# EAGLE design MultiSensor_MPL_PCA_0805 (EAGLE 9.5.2)
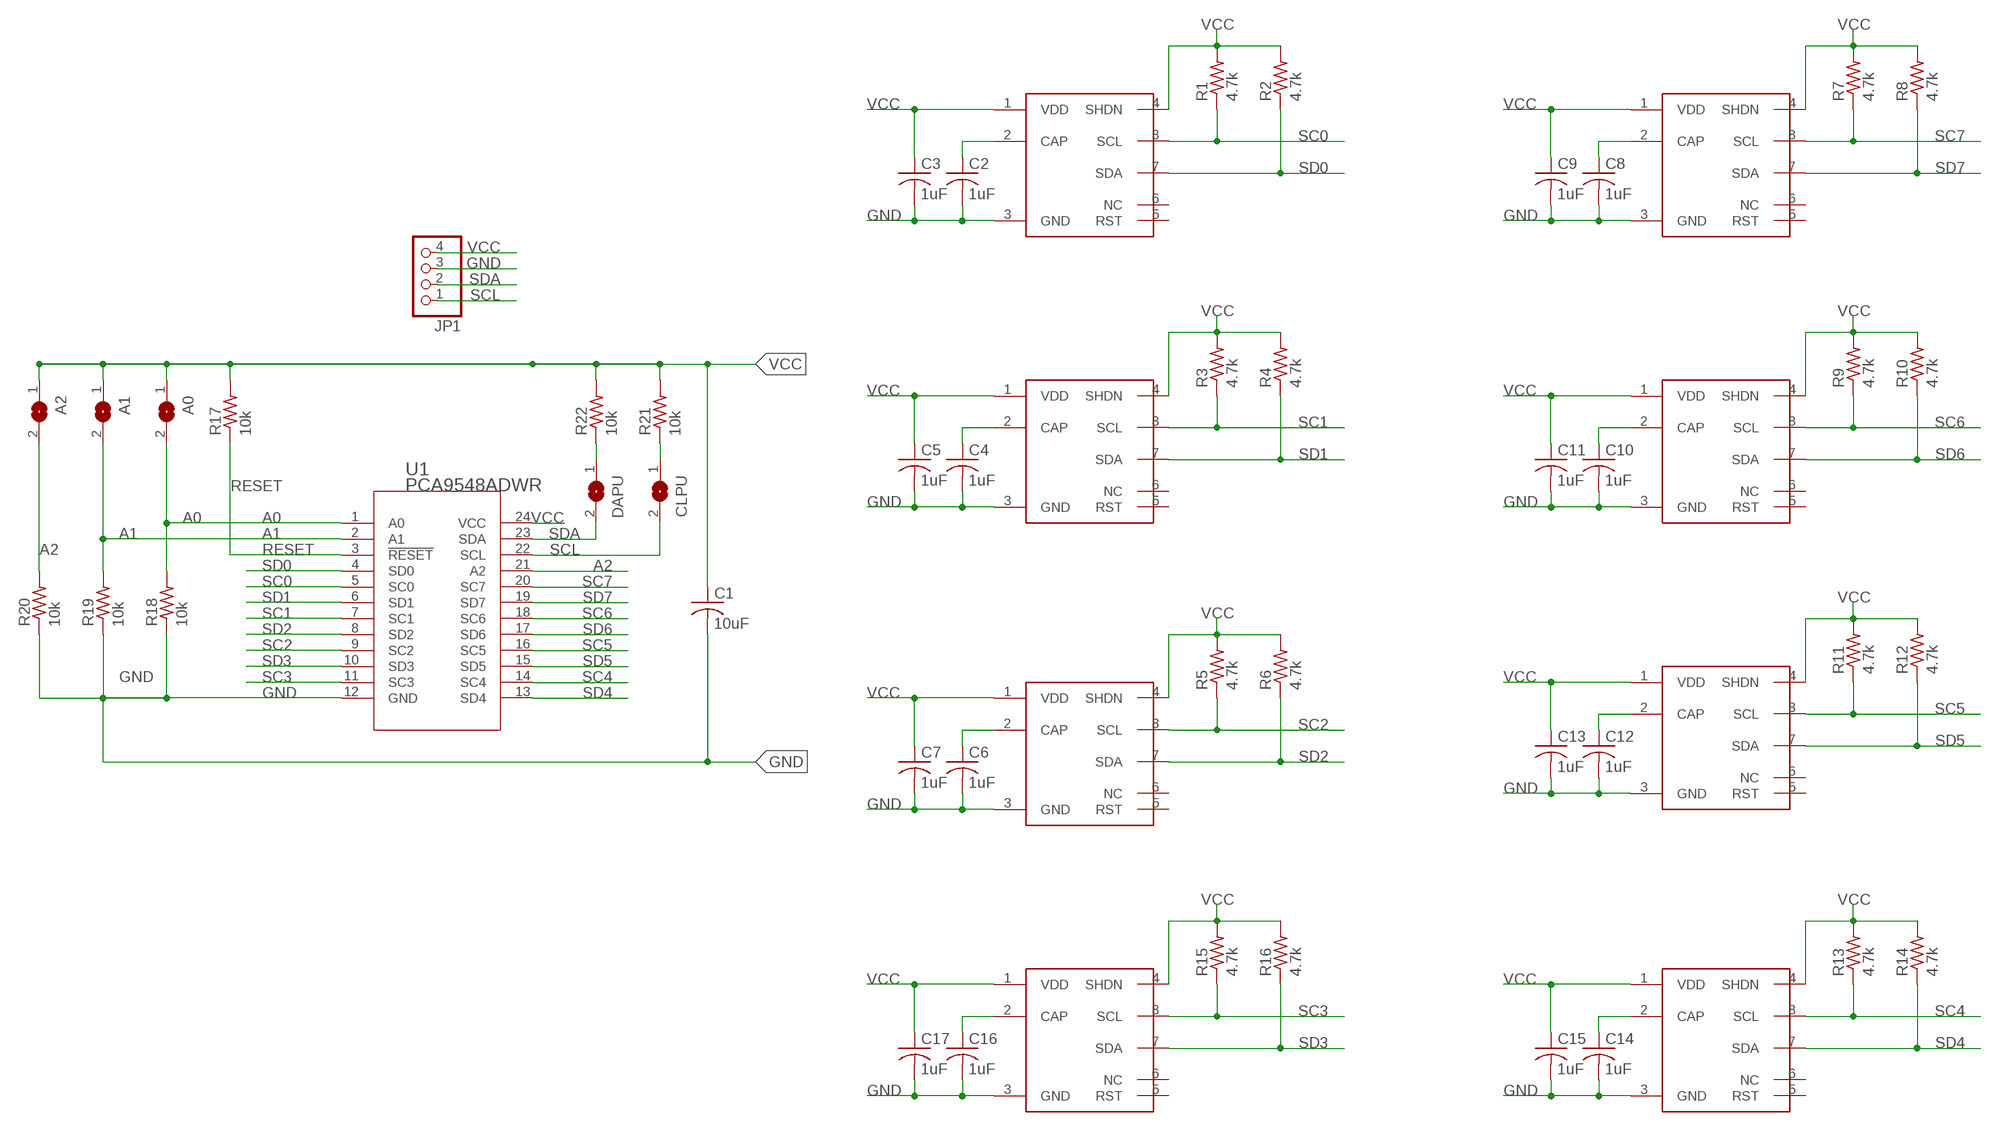
[diagram p0: schematic, sheet 1]

## Parts
A0  SJ  [SJ]
A1  SJ  [SJ]
A2  SJ  [SJ]
B1  MPL115A2T1  [MPL115A2T1]
B2  MPL115A2T1  [MPL115A2T1]
B3  MPL115A2T1  [MPL115A2T1]
B4  MPL115A2T1  [MPL115A2T1]
B5  MPL115A2T1  [MPL115A2T1]
B6  MPL115A2T1  [MPL115A2T1]
B7  MPL115A2T1  [MPL115A2T1]
B8  MPL115A2T1  [MPL115A2T1]
C1  10uF  C-USC1206  [C1206]
C2  1uF  C-USC0805  [C0805]
C3  1uF  C-USC0805  [C0805]
C4  1uF  C-USC0805  [C0805]
C5  1uF  C-USC0805  [C0805]
C6  1uF  C-USC0805  [C0805]
C7  1uF  C-USC0805  [C0805]
C8  1uF  C-USC0805  [C0805]
C9  1uF  C-USC0805  [C0805]
C10  1uF  C-USC0805  [C0805]
C11  1uF  C-USC0805  [C0805]
C12  1uF  C-USC0805  [C0805]
C13  1uF  C-USC0805  [C0805]
C14  1uF  C-USC0805  [C0805]
C15  1uF  C-USC0805  [C0805]
C16  1uF  C-USC0805  [C0805]
C17  1uF  C-USC0805  [C0805]
CLPU  SJ  [SJ]
DAPU  SJ  [SJ]
JP1  PINHD-1X4  [1X04]
R1  4.7k  R-US_R0805  [R0805]
R2  4.7k  R-US_R0805  [R0805]
R3  4.7k  R-US_R0805  [R0805]
R4  4.7k  R-US_R0805  [R0805]
R5  4.7k  R-US_R0805  [R0805]
R6  4.7k  R-US_R0805  [R0805]
R7  4.7k  R-US_R0805  [R0805]
R8  4.7k  R-US_R0805  [R0805]
R9  4.7k  R-US_R0805  [R0805]
R10  4.7k  R-US_R0805  [R0805]
R11  4.7k  R-US_R0805  [R0805]
R12  4.7k  R-US_R0805  [R0805]
R13  4.7k  R-US_R0805  [R0805]
R14  4.7k  R-US_R0805  [R0805]
R15  4.7k  R-US_R0805  [R0805]
R16  4.7k  R-US_R0805  [R0805]
R17  10k  R-US_R0805  [R0805]
R18  10k  R-US_R0805  [R0805]
R19  10k  R-US_R0805  [R0805]
R20  10k  R-US_R0805  [R0805]
R21  10k  R-US_R0805  [R0805]
R22  10k  R-US_R0805  [R0805]
U1  PCA9548ADWR  [DW24]

## Nets
A0: A0.2 R18.2 U1.1(A0)
A1: A1.2 R19.2 U1.2(A1)
A2: A2.2 R20.2 U1.21(A2)
CAP1: B1.2(CAP) C2.1
CAP2: B2.2(CAP) C4.1
CAP3: B3.2(CAP) C6.1
CAP4: B8.2(CAP) C16.1
CAP5: B7.2(CAP) C14.1
CAP6: B6.2(CAP) C12.1
CAP7: B5.2(CAP) C10.1
CAP8: B4.2(CAP) C8.1
GND: B1.3(GND) B2.3(GND) B3.3(GND) B4.3(GND) B5.3(GND) B6.3(GND) B7.3(GND) B8.3(GND) C1.2 C2.2 C3.2 C4.2 C5.2 C6.2 C7.2 C8.2 C9.2 C10.2 C11.2 C12.2 C13.2 C14.2 C15.2 C16.2 C17.2 JP1.3 R18.1 R19.1 R20.1 U1.12(GND)
N$1: DAPU.1 R22.1
N$2: CLPU.1 R21.1
RESET: R17.1 U1.3(!RESET)
SC0: B1.8(SCL) R1.1 U1.5(SC0)
SC1: B2.8(SCL) R3.1 U1.7(SC1)
SC2: B3.8(SCL) R5.1 U1.9(SC2)
SC3: B8.8(SCL) R15.1 U1.11(SC3)
SC4: B7.8(SCL) R13.1 U1.14(SC4)
SC5: B6.8(SCL) R11.1 U1.16(SC5)
SC6: B5.8(SCL) R9.1 U1.18(SC6)
SC7: B4.8(SCL) R7.1 U1.20(SC7)
SCL: CLPU.2 JP1.1 U1.22(SCL)
SD0: B1.7(SDA) R2.1 U1.4(SD0)
SD1: B2.7(SDA) R4.1 U1.6(SD1)
SD2: B3.7(SDA) R6.1 U1.8(SD2)
SD3: B8.7(SDA) R16.1 U1.10(SD3)
SD4: B7.7(SDA) R14.1 U1.13(SD4)
SD5: B6.7(SDA) R12.1 U1.15(SD5)
SD6: B5.7(SDA) R10.1 U1.17(SD6)
SD7: B4.7(SDA) R8.1 U1.19(SD7)
SDA: DAPU.2 JP1.2 U1.23(SDA)
VCC: A0.1 A1.1 A2.1 B1.1(VDD) B1.4(SHDN) B2.1(VDD) B2.4(SHDN) B3.1(VDD) B3.4(SHDN) B4.1(VDD) B4.4(SHDN) B5.1(VDD) B5.4(SHDN) B6.1(VDD) B6.4(SHDN) B7.1(VDD) B7.4(SHDN) B8.1(VDD) B8.4(SHDN) C1.1 C3.1 C5.1 C7.1 C9.1 C11.1 C13.1 C15.1 C17.1 JP1.4 R1.2 R2.2 R3.2 R4.2 R5.2 R6.2 R7.2 R8.2 R9.2 R10.2 R11.2 R12.2 R13.2 R14.2 R15.2 R16.2 R17.2 R21.2 R22.2 U1.24(VCC)
Unconnected: B1.5(RST) B1.6(NC) B2.5(RST) B2.6(NC) B3.5(RST) B3.6(NC) B4.5(RST) B4.6(NC) B5.5(RST) B5.6(NC) B6.5(RST) B6.6(NC) B7.5(RST) B7.6(NC) B8.5(RST) B8.6(NC)

## Library data of the parts
A0 A1 A2 CLPU DAPU = jumper:SJ: SMD solder JUMPER
B1-B8 = MPL115A2T1:MPL115A2T1: MEMS Barometer from NXP Semiconductors. DATASHEET: https://www.nxp.com/docs/en/data-sheet/MPL115A2.pdf
C1-C17 = rcl:C-US: CAPACITOR, American symbol; SPICEPREFIX: C
JP1 = pinhead:PINHD-1X4: PIN HEADER
R1-R16 = rcl:R-US_: RESISTOR, American symbol; SPICEPREFIX: R
R17-R22 = resistor:R-US_: RESISTOR, American symbol
U1 = PCA9548ADWR:PCA9548ADWR; DATASHEET_URL: http://www.ti.com/lit/gpn/PCA9548A; DESCRIPTION: 8-Channel I2C Switch With Reset; FAMILY_NAME: I2C MULTIPLEXER, SWITCH; GENERIC_PART_NUMBER: PCA9548A; INDUSTRY_STD_PKG_TYPE: SOIC; MANUFACTURER: Texas Instruments; MANUFACTURER_PART_NUMBER: PCA9548ADWR; PACKAGE_DESIGNATOR: DW; PIN_COUNT: 24; VENDOR: Texas Instruments

## Board
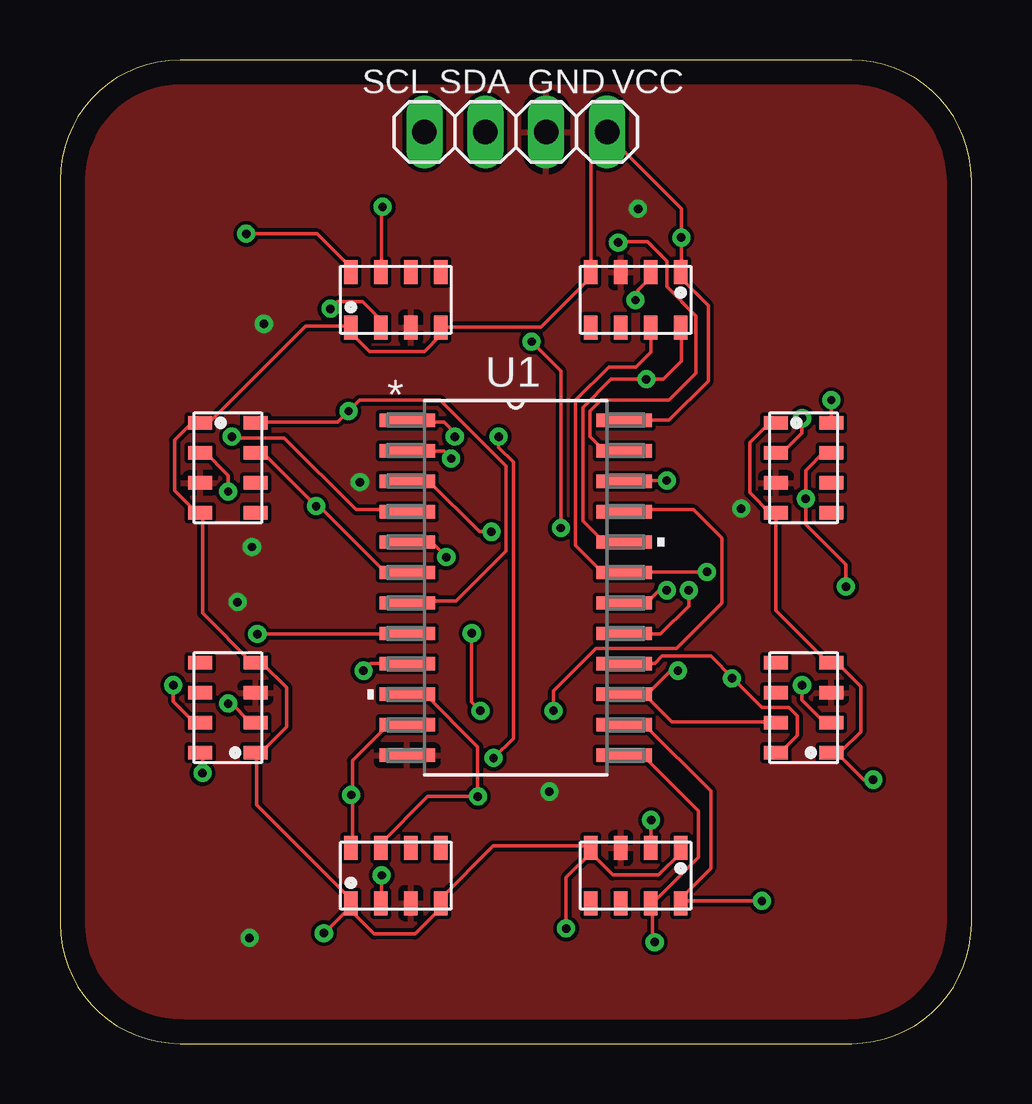
[diagram p1: board, top side]
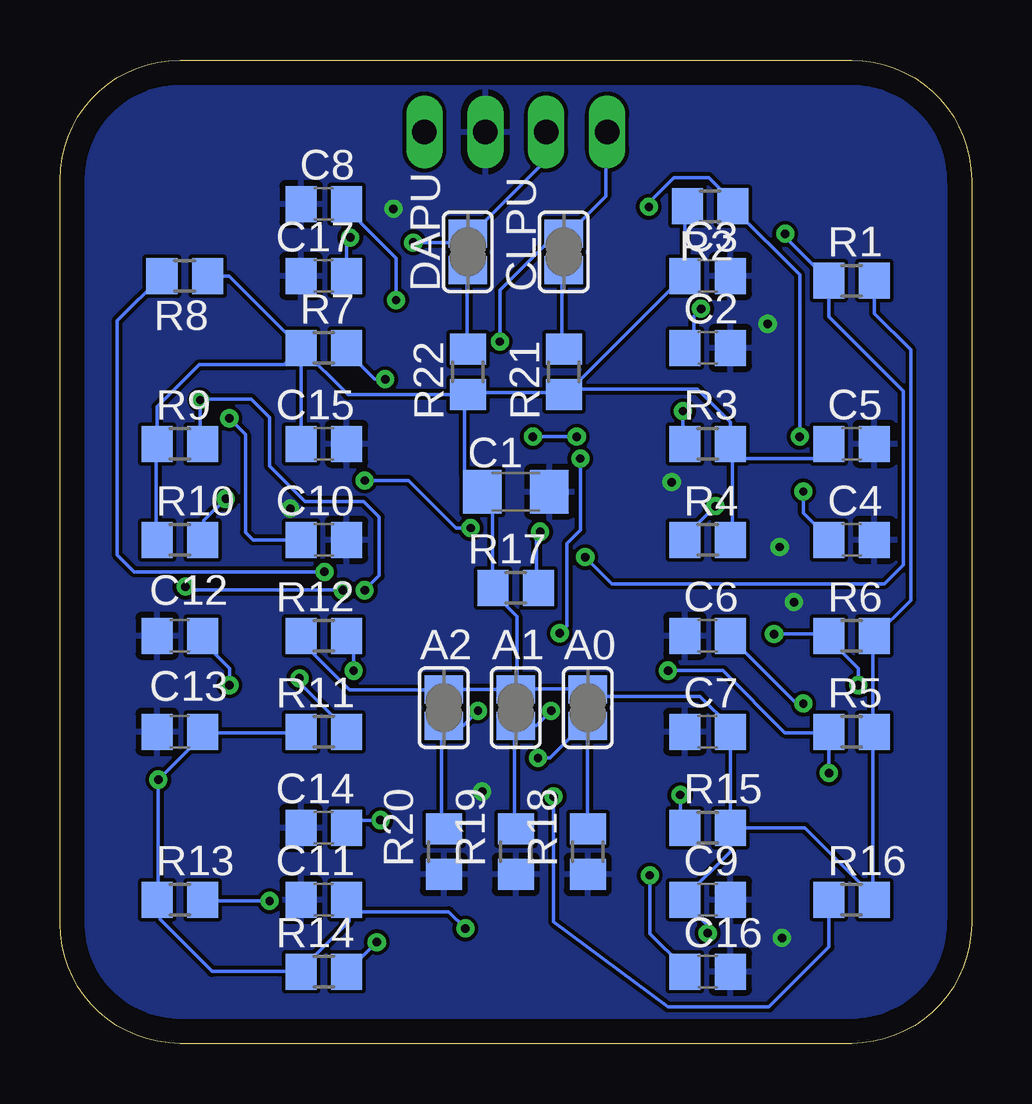
[diagram p2: board, bottom side, seen from below]

Size 38 x 41 mm. Coordinates in mm from the lower left corner, seen from the top.
Outline: 38,5 38,36 arc90 33,41 5,41 arc90 0,36 0,5 arc90 5,0 33,0 arc90 38,5
Copper layers (1*16): Top 0.035mm / dielectric 1.5mm / Bottom 0.035mm
Design rules "default": minimum track width 6mil, minimum drill 0.35mm, track to track 6mil, track to pad 6mil, pad to pad 6mil, via to via 6mil, smd to smd 6mil, copper to edge 40mil, drill to drill 6mil, minimum pad ring 10mil, minimum via ring 8mil, stop-mask expansion 4mil, vias tented up to drill 0mil, thermal gap 10mil

### Footprints (pad centres in the part's own frame; a part is rotated, then mirrored left to right if it is on the bottom)
SJ = smd 1.168 x 1.6: 1 -0.762,0; 2 0.762,0
MPL115A2T1 = smd 1 x 0.55: 1 -1.15,1.875; 2 -1.15,0.625; 3 -1.15,-0.625; 4 -1.15,-1.875; 5 1.15,-1.875; 6 1.15,-0.625; 7 1.15,0.625; 8 1.15,1.875
C1206 = smd 1.6 x 1.8: 1 -1.4,0; 2 1.4,0
C0805 = smd 1.3 x 1.5: 1 -0.95,0; 2 0.95,0
1X04 = drill 1.016 long: 1 -3.81,0; 2 -1.27,0; 3 1.27,0; 4 3.81,0
R0805 = smd 1.3 x 1.5: 1 -0.95,0; 2 0.95,0
DW24 = smd 2.311 x 0.559: 1 -4.521,6.985; 2 -4.521,5.715; 3 -4.521,4.445; 4 -4.521,3.175; 5 -4.521,1.905; 6 -4.521,0.635; 7 -4.521,-0.635; 8 -4.521,-1.905; 9 -4.521,-3.175; 10 -4.521,-4.445; 11 -4.521,-5.715; 12 -4.521,-6.985; 13 4.521,-6.985; 14 4.521,-5.715; 15 4.521,-4.445; 16 4.521,-3.175; 17 4.521,-1.905; 18 4.521,-0.635; 19 4.521,0.635; 20 4.521,1.905; 21 4.521,3.175; 22 4.521,4.445; 23 4.521,5.715; 24 4.521,6.985

### Placement (x,y rotation side)
A0  16,14 270 bottom
A1  19,14 270 bottom
A2  22,14 270 bottom
B1  14,31 90 top
B2  7,24 0 top
B3  7,14 180 top
B4  24,31 270 top
B5  31,24 0 top
B6  31,14 180 top
B7  24,7 270 top
B8  14,7 90 top
C1  19,23 0 bottom
C2  11,29 0 bottom
C3  11,32 0 bottom
C4  5,21 0 bottom
C5  5,25 0 bottom
C6  11,17 180 bottom
C7  11,13 180 bottom
C8  27,35 180 bottom
C9  11,6 0 bottom
C10  27,21 0 bottom
C11  27,6 180 bottom
C12  33,17 180 bottom
C13  33,13 180 bottom
C14  27,9 180 bottom
C15  27,25 0 bottom
C16  11,3 0 bottom
C17  27,32 180 bottom
CLPU  17,33 90 bottom
DAPU  21,33 90 bottom
JP1  19,38 0 top
R1  5,31.8 0 bottom
R2  10.9,34.9 180 bottom
R3  11,25 0 bottom
R4  11,21 0 bottom
R5  5,13 0 bottom
R6  5,17 0 bottom
R7  27,29 180 bottom
R8  32.8,32 0 bottom
R9  33,25 180 bottom
R10  33,21 180 bottom
R11  27,13 180 bottom
R12  27,17 180 bottom
R13  33,6 180 bottom
R14  27,3 180 bottom
R15  11,9 0 bottom
R16  5,6 0 bottom
R17  19,19 180 bottom
R18  16,8 90 bottom
R19  19,8 90 bottom
R20  22,8 90 bottom
R21  17,28 270 bottom
R22  21,28 270 bottom
U1  19,19 0 top

### Tracks (layer width: path | path; a pad name or v marks a point on that pad's centre or on a via)
A0  (via drill 0.35)
  Top 0.152: v16.46,25.3 16.46,25.45 16,25.91 14.63,25.91 U1.1 | v18.29,25.3 18.29,24.84 18.9,24.23 18.9,12.73 v18.07,11.9
  Bottom 0.152: 16,13.11 16,8.99 R18.2 | v18.29,25.3 v16.46,25.3 | v18.07,11.9 17.57,11.9 16.37,13.11 16,13.11 | 16,13.11 A0.2
A1  (via drill 0.35)
  Top 0.152: v16.31,24.38 16,24.69 14.63,24.69 U1.2 | v17.16,17.1 17.16,14.23 v17.53,13.87
  Bottom 0.152: R19.2 19.05,8.99 19.05,13.11 A1.2 18.9,13.26 18.14,13.26 v17.53,13.87 | v16.31,24.38 v16.3,24.38 16.3,21.4 16.86,20.84 16.86,17.4 v17.16,17.1
A2  (via drill 0.35)
  Top 0.152: v20.57,13.87 20.57,14.69 22.35,16.46 25.69,16.46 27.58,18.36 27.58,21.06 26.4,22.25 23.62,22.25 U1.21
  Bottom 0.152: R20.2 22.1,8.99 22.1,13.11 A2.2 21.95,13.26 21.18,13.26 v20.57,13.87
CAP1  (via drill 0.35)
  Top 0.152: B1.2 13.41,29.89 13.41,30.13 12.61,30.94 11.58,30.94 v11.28,30.63
  Bottom 0.152: v11.28,30.63 11.58,30.33 11.58,29.41 11.89,29.11 C2.1
CAP2  (via drill 0.35)
  Top 0.152: v7.01,23.01 7.01,23.68 6.01,24.69 5.94,24.69 B2.2
  Bottom 0.152: v7.01,23.01 7.01,22.11 6.1,21.2 6.1,21.03 C4.1
CAP3  (via drill 0.35)
  Top 0.152: v7.01,14.17 7.15,14.17 7.92,13.41 8.08,13.41 B3.2
  Bottom 0.152: C6.1 10.05,16.92 7.31,14.17 v7.01,14.17
CAP4  (via drill 0.35)
  Top 0.152: v13.41,7.01 13.41,5.94 B8.2
  Bottom 0.152: v13.41,7.01 13.41,4.58 12.04,3.21 12.04,3.05 C16.1
CAP5  (via drill 0.35)
  Top 0.152: B7.2 24.62,9.29 v24.64,9.31
  Bottom 0.152: C14.1 25.74,9.31 v24.64,9.31
CAP6  (via drill 0.35)
  Top 0.152: v30.94,14.94 30.94,14.32 31.84,13.41 32,13.41 B6.2
  Bottom 0.152: v30.94,14.94 30.94,15.63 31.7,16.4 31.7,16.61 32,16.92 C12.1
CAP7  (via drill 0.35)
  Top 0.152: v30.94,26.06 30.94,25.44 30.18,24.69 29.87,24.69 B5.2
  Bottom 0.152: v30.94,26.06 30.26,25.38 30.26,21.31 29.95,21 C10.1
CAP8  (via drill 0.35)
  Top 0.152: B4.2 24.62,31.95 24.09,31.41 24.09,31.09 v23.99,30.99
  Bottom 0.152: C8.1 26.05,34.8 23.99,32.74 v23.99,30.99
GND  (via drill 0.35)
  other vias: 8,20.7 7.9,4.4 8.5,30 24.1,34.8 7.4,18.4 28.4,22.3 20.4,10.5 12.5,23.4
  pour Bottom: 0,41 0,0 38,0 38,41
  pour Top: 0,41 0,0 38,0 38,41
N$1
  Bottom 0.152: R22.1 21.03,28.96 21.03,32.16 DAPU.1
N$2
  Bottom 0.152: R21.1 17.07,28.96 17.07,32.16 CLPU.1
RESET  (via drill 0.35)
  Top 0.152: v17.98,21.34 17.48,21.34 15.35,23.47 14.63,23.47 U1.3
  Bottom 0.152: v17.98,21.34 18.14,21.18 18.14,19.05 R17.1
SC0  (via drill 0.35)
  Top 0.152: B1.8 12.12,32.35 10.72,33.76 v7.76,33.76 | U1.5 15.48,20.91 v16.11,20.28
  Bottom 0.152: v16.11,20.28 14.99,19.16 3.64,19.16 2.84,19.96 2.84,27.19 5.95,30.3 R1.1 7.76,33.61 v7.76,33.76
SC1  (via drill 0.35)
  Top 0.152: B2.8 8.23,25.91 11.57,25.91 v12.03,26.36 12.49,26.82 15.85,26.82 18.59,24.08 18.59,20.53 16.5,18.44 14.63,18.44 U1.7
  Bottom 0.152: v12.03,26.36 12.04,26.36 12.04,25.15 R3.1
SC2  (via drill 0.35)
  Top 0.152: v5.94,11.28 5.94,12.04 B3.8 | v12.65,15.54 12.95,15.85 14.48,15.85 U1.9
  Bottom 0.152: v5.94,11.28 5.94,12.95 R5.1 6.1,12.95 7.77,12.95 10.36,15.54 v12.65,15.54
SC3  (via drill 0.35)
  Top 0.152: 12.19,10.36 12.19,11.8 13.65,13.26 14.48,13.26 U1.11 | 12.19,10.36 12.19,8.23 B8.8 | 12.19,10.36 v12.14,10.36
  Bottom 0.152: v12.14,10.36 12.14,9.3 R15.1
SC4  (via drill 0.35)
  Top 0.152: U1.14 23.62,13.26 24.39,13.26 27.13,10.53 27.13,7.31 25.88,6.05 B7.8 25.97,5.94 26.79,5.94 26.9,5.94 v29.26,5.94
  Bottom 0.152: v29.26,5.94 32,5.94 R13.1
SC5  (via drill 0.35)
  Top 0.152: 28.04,15.24 27.13,16.15 25.1,16.15 24.79,15.85 23.62,15.85 U1.16 | 28.04,15.24 29.26,14.02 30.38,14.02 30.74,13.66 30.74,12.84 30.09,12.19 29.87,12.19 B6.8 | 28.04,15.24 v28.02,15.23
  Bottom 0.152: v28.02,15.23 28.02,15.03 26.06,13.06 R11.1
SC6  (via drill 0.35)
  Top 0.152: v32.16,26.82 32.16,25.91 B5.8 | v25.3,18.9 25,18.9 24.39,18.29 23.62,18.29 U1.18
  Bottom 0.152: R9.1 32.16,25.15 v32.16,26.82 32.16,26.87 30.03,26.87 29.26,26.1 29.26,24.08 27.78,22.6 25.35,22.6 24.69,21.95 24.69,19.51 v25.3,18.9
SC7  (via drill 0.35)
  Top 0.152: B4.8 25.91,29.72 25.91,28.46 25.15,27.69 v24.44,27.69 22.97,27.69 21.79,26.52 21.79,21.78 22.7,20.88 23.47,20.88 U1.20
  Bottom 0.152: R7.1 26.05,28.86 24.89,27.69 v24.44,27.69
SCL  (via drill 0.35)
  Top 0.152: v25.3,23.47 23.62,23.47 U1.22 | v20.88,21.49 20.88,28.04 v19.66,29.26
  Bottom 0.152: JP1.1 15.24,37.95 15.24,35.32 16.8,33.76 CLPU.2 17.07,33.83 17.23,33.83 19.66,31.4 v19.66,29.26 | v25.3,23.47 23.47,23.47 21.49,21.49 v20.88,21.49
SD0  (via drill 0.35)
  Top 0.152: v13.45,34.88 13.41,34.84 13.41,32.16 B1.7 | v7.16,25.3 7.21,25.25 9.35,25.25 12.34,22.25 14.48,22.25 U1.4
  Bottom 0.152: v7.16,25.3 7.16,32.04 9.95,34.83 R2.1 9.95,35.1 10.95,36.1 12.4,36.1 13.45,35.05 v13.45,34.88
SD1  (via drill 0.35)
  Top 0.152: B2.7 8.23,24.69 8.39,24.69 v10.68,22.4 10.81,22.4 13.55,19.66 14.48,19.66 U1.6
  Bottom 0.152: v10.68,22.4 11.89,21.19 11.89,21.03 R4.1
SD2  (via drill 0.35)
  Top 0.152: B3.7 5.79,13.31 5.68,13.31 4.72,14.26 v4.72,14.94 | v8.23,17.07 14.48,17.07 U1.8
  Bottom 0.152: v4.72,14.94 4.72,15.63 6.04,16.95 R6.1 6.1,17.07 v8.23,17.07
SD3  (via drill 0.35)
  Top 0.152: U1.10 14.63,14.63 15.15,14.63 17.41,12.37 17.41,10.31 v17.42,10.3 15.32,10.3 13.38,8.35 B8.7
  Bottom 0.152: v17.42,10.3 17.42,5.08 12.65,1.52 8.44,1.52 5.94,4.02 5.94,5.94 R16.1
SD4  (via drill 0.35)
  Top 0.152: U1.13 23.62,11.89 24.43,11.89 26.62,9.69 26.62,7.77 24.7,5.85 B7.7 24.69,5.79 24.69,4.33 v24.79,4.22
  Bottom 0.152: v24.79,4.22 25.91,3.11 25.91,3.05 R14.1
SD5  (via drill 0.35)
  Top 0.152: B6.7 29.72,13.41 25.51,13.41 24.37,14.55 U1.15 23.62,14.63 24.55,14.63 25.46,15.54 v25.76,15.54
  Bottom 0.152: R12.1 25.76,16.71 v25.76,15.54
SD6  (via drill 0.35)
  Top 0.152: B5.7 32,24.69 31.89,24.69 31.09,23.88 v31.09,22.71 31.09,21.64 32.77,19.96 v32.77,19.05 | v26.21,18.9 26.21,18.24 25.04,17.07 23.62,17.07 U1.17
  Bottom 0.152: v31.09,22.71 32,21.79 32,21.03 R10.1 | v26.21,18.9 32.61,18.9 v32.77,19.05
SD7  (via drill 0.35)
  Top 0.152: v26.98,19.66 23.62,19.66 U1.19 23.47,19.66 22.6,19.66 21.49,20.77 21.49,26.81 22.88,28.2 24,28.2 24.62,28.82 B4.7
  Bottom 0.152: v26.98,19.66 34.9,19.66 35.6,20.36 35.6,30.15 R8.1
SDA  (via drill 0.35)
  Top 0.152: v23.27,33.39 23.3,33.42 24.49,33.42 25.3,32.61 25.3,31.55 26.52,30.33 26.52,27.96 25.38,26.82 22.55,26.82 22.1,26.36 22.1,25.3 22.56,24.84 23.47,24.84 U1.23
  Bottom 0.152: JP1.2 17.83,37.95 17.83,36.74 20.81,33.76 DAPU.2 21.03,33.83 21.19,33.83 21.64,33.39 v23.27,33.39
VCC  (via drill 0.35)
  Top 0.152: B7.1 25.88,7.95 24.95,7.03 23.05,7.03 22.12,7.95 | 22.12,7.95 B7.4 22.1,8.23 18.05,8.23 15.88,6.06 B8.4 15.88,5.66 14.79,4.57 13.1,4.57 12.19,5.48 12.19,5.79 B8.1 | 8.43,15.85 9.45,14.84 9.45,13.2 8.44,12.19 8.23,12.19 8.2,12.16 | 8.23,15.85 8.43,15.85 | 8.23,15.85 8.03,15.85 5.94,17.94 5.94,22.1 B2.4 5.79,22.1 5.73,22.1 4.77,23.05 4.77,25.15 5.53,25.91 5.79,25.91 B2.1 6.23,26.01 6.35,26.01 10.25,29.9 12.07,29.9 B1.1 12.19,29.72 12.19,29.56 12.9,28.85 15.19,28.85 15.85,29.51 15.85,29.72 B1.4 16,29.87 20.05,29.87 22.1,31.91 22.1,32.16 B4.4 22.12,37.31 22.75,37.95 | 8.43,15.85 8.53,15.85 B3.4 8.23,15.85 | 8.2,12.16 B3.1 | 8.2,12.16 8.2,9.95 11.94,6.21 11.94,6.05 B8.1 | 32.16,15.85 32.06,15.85 29.85,18.06 B5.4 | 32.16,15.85 32.42,15.85 33.38,14.89 33.38,13 32.57,12.19 32.16,12.19 B6.1 32.38,12.12 33.5,11 v33.9,11 | 32.16,15.85 B6.4 | 29.72,22.1 29.91,22.1 29.91,22.12 B5.4 | 29.72,22.1 29.61,22.1 28.75,22.96 28.75,25.05 29.61,25.91 29.72,25.91 29.77,25.89 B5.1 | 29.72,22.1 B5.4 | 22.75,37.95 JP1.4 | U1.24 25.39,25.98 27.02,27.62 27.02,30.75 25.88,31.9 B4.1 25.9,32.17 v25.9,33.6 25.9,34.8 22.75,37.95 | v11,4.6 12.12,5.72 B8.1 | 22.12,7.95 21.1,6.92 v21.1,4.8
  Bottom 0.152: R10.2 33.98,21.03 33.98,24.99 R9.2 33.95,26.55 32.2,28.3 28.65,28.3 R7.2 | R15.2 10.06,8 11.95,6.11 C9.1 11.95,5.85 11,4.9 v11,4.6 | R15.2 10.06,9.14 10.06,12.95 C7.1 10.06,13.11 10.06,13.22 11.32,14.48 15.7,14.48 15.85,14.63 A0.1 16,14.78 18.8,14.78 | 4.12,16.9 4.12,13.11 R5.2 4.12,12.95 4.12,6.1 R16.2 4.05,6.1 6.94,8.99 R15.2 | 4.12,16.9 4.12,16.92 R6.2 | R3.2 10.05,24.9 | R3.2 9.45,24.39 6.41,24.39 5.95,24.85 C5.1 | R4.2 9.96,21.09 9.96,24.8 10.05,24.9 | R3.2 10.06,24.54 10.06,24.6 10.06,24.74 10.05,24.9 | R3.2 | 27.89,3.5 27.89,3.57 27.47,3.57 26.05,4.99 | 27.89,3.05 27.89,3 31.66,3 33.83,5.18 33.83,5.94 R13.2 33.98,6.1 33.9,6.18 v33.9,11 32.05,12.85 C13.1 32,12.95 28.04,12.95 R11.2 | 27.89,3.5 27.89,3.05 | 27.89,3.05 R14.2 27.89,3.5 | 26.05,4.99 25.95,5.09 25.95,5.5 21.8,5.5 v21.1,4.8 | 26.05,4.99 C11.1 | A2.1 22.03,14.73 22.1,14.73 | 22.1,14.73 25.93,14.73 28.04,16.84 28.04,16.92 R12.2 | 18.8,14.78 18.9,14.78 A1.1 22.07,14.76 22.1,14.73 | R22.2 20.88,27.13 17.07,27.13 R21.2 17,27.08 16.7,27.38 16.6,27.38 | 16.6,27.38 16.7,27.28 11.44,27.28 10.06,25.91 10.06,25.15 R3.2 | 16.6,27.38 11.98,32 C3.1 11.95,34.8 R2.2 | R22.2 21.13,26.73 21.13,23.68 20.45,23 C1.1 20.27,22.86 19.96,22.55 19.96,19.05 R17.2 19.95,18.8 18.95,17.8 18.95,14.93 18.8,14.78 | R22.2 26,27.05 R7.2 | v25.9,33.6 26.06,33.44 26.06,31.85 26.06,31.9 C17.1 | R7.2 30.95,32 R8.2 | R1.2 4.05,30.43 2.54,28.92 2.54,18.48 4.12,16.9 | R7.2 C15.1

### Text on the board
tNames: SCL | SDA | GND | VCC